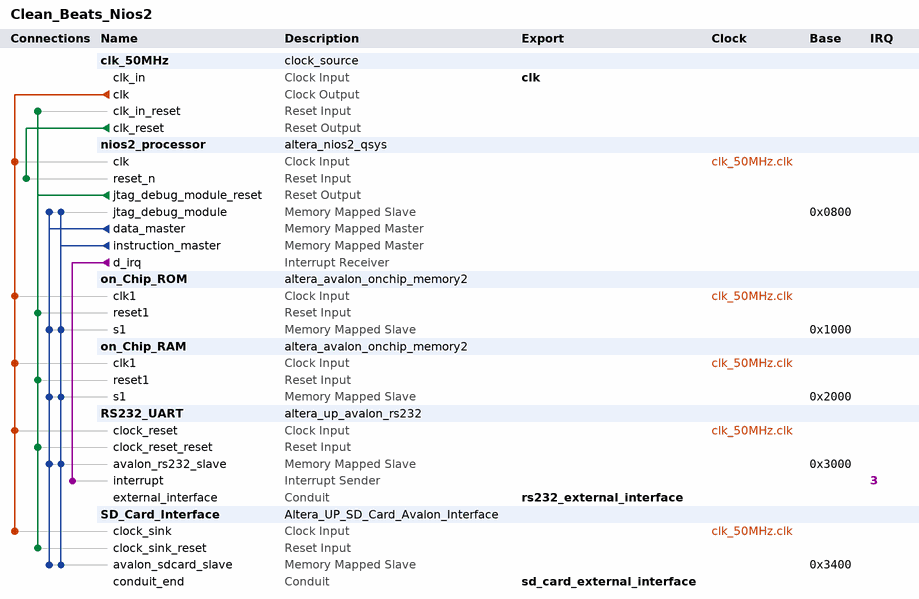
[diagram p0: system contents]
# Platform Designer (Qsys) system Clean_Beats_Nios2, Cyclone III EP3C16F484C6
# Parameters at their usual value, and those the tool derives, are not listed.
package require -exact qsys 12.1
create_system Clean_Beats_Nios2
set_project_property DEVICE_FAMILY {Cyclone III}
set_project_property DEVICE EP3C16F484C6

add_instance clk_50MHz clock_source 12.1
set_instance_parameter_value clk_50MHz clockFrequency 50000000

add_instance nios2_processor altera_nios2_qsys 12.1
set_instance_parameter_value nios2_processor setting_preciseIllegalMemAccessException true
set_instance_parameter_value nios2_processor setting_illegalInstructionsTrap true
set_instance_parameter_value nios2_processor mmu_enabled true
set_instance_parameter_value nios2_processor mmu_TLBMissExcOffset 64
set_instance_parameter_value nios2_processor resetSlave Absolute
set_instance_parameter_value nios2_processor mmu_TLBMissExcSlave Absolute
set_instance_parameter_value nios2_processor exceptionSlave Absolute
set_instance_parameter_value nios2_processor breakSlave nios2_processor.jtag_debug_module
set_instance_parameter_value nios2_processor impl Fast
set_instance_parameter_value nios2_processor icache_size 4096

add_instance on_Chip_ROM altera_avalon_onchip_memory2 12.1
set_instance_parameter_value on_Chip_ROM dataWidth 32
set_instance_parameter_value on_Chip_ROM dualPort false
set_instance_parameter_value on_Chip_ROM initMemContent true
set_instance_parameter_value on_Chip_ROM initializationFileName on_Chip_ROM
set_instance_parameter_value on_Chip_ROM memorySize 4096
set_instance_parameter_value on_Chip_ROM writable false

add_instance on_Chip_RAM altera_avalon_onchip_memory2 12.1
set_instance_parameter_value on_Chip_RAM dataWidth 32
set_instance_parameter_value on_Chip_RAM dualPort false
set_instance_parameter_value on_Chip_RAM initMemContent true
set_instance_parameter_value on_Chip_RAM initializationFileName on_Chip_RAM
set_instance_parameter_value on_Chip_RAM memorySize 4096

add_instance RS232_UART altera_up_avalon_rs232 12.0
set_instance_parameter_value RS232_UART baud 9600
set_instance_parameter_value RS232_UART parity None

add_instance SD_Card_Interface Altera_UP_SD_Card_Avalon_Interface 1.0

# connections
add_connection clk_50MHz.clk nios2_processor.clk clock
add_connection clk_50MHz.clk on_Chip_RAM.clk1 clock
add_connection clk_50MHz.clk on_Chip_ROM.clk1 clock
add_connection clk_50MHz.clk RS232_UART.clock_reset clock
add_connection clk_50MHz.clk SD_Card_Interface.clock_sink clock
add_connection clk_50MHz.clk_reset nios2_processor.reset_n reset
add_connection nios2_processor.jtag_debug_module_reset clk_50MHz.clk_in_reset reset
add_connection nios2_processor.jtag_debug_module_reset on_Chip_RAM.reset1 reset
add_connection nios2_processor.jtag_debug_module_reset on_Chip_ROM.reset1 reset
add_connection nios2_processor.jtag_debug_module_reset RS232_UART.clock_reset_reset reset
add_connection nios2_processor.jtag_debug_module_reset SD_Card_Interface.clock_sink_reset reset
add_connection nios2_processor.data_master nios2_processor.jtag_debug_module avalon
set_connection_parameter_value nios2_processor.data_master/nios2_processor.jtag_debug_module baseAddress 0x0800
add_connection nios2_processor.data_master on_Chip_RAM.s1 avalon
set_connection_parameter_value nios2_processor.data_master/on_Chip_RAM.s1 baseAddress 0x2000
add_connection nios2_processor.data_master on_Chip_ROM.s1 avalon
set_connection_parameter_value nios2_processor.data_master/on_Chip_ROM.s1 baseAddress 0x1000
add_connection nios2_processor.data_master RS232_UART.avalon_rs232_slave avalon
set_connection_parameter_value nios2_processor.data_master/RS232_UART.avalon_rs232_slave baseAddress 0x3000
add_connection nios2_processor.data_master SD_Card_Interface.avalon_sdcard_slave avalon
set_connection_parameter_value nios2_processor.data_master/SD_Card_Interface.avalon_sdcard_slave baseAddress 0x3400
add_connection nios2_processor.instruction_master nios2_processor.jtag_debug_module avalon
set_connection_parameter_value nios2_processor.instruction_master/nios2_processor.jtag_debug_module baseAddress 0x0800
add_connection nios2_processor.instruction_master on_Chip_RAM.s1 avalon
set_connection_parameter_value nios2_processor.instruction_master/on_Chip_RAM.s1 baseAddress 0x2000
add_connection nios2_processor.instruction_master on_Chip_ROM.s1 avalon
set_connection_parameter_value nios2_processor.instruction_master/on_Chip_ROM.s1 baseAddress 0x1000
add_connection nios2_processor.instruction_master RS232_UART.avalon_rs232_slave avalon
set_connection_parameter_value nios2_processor.instruction_master/RS232_UART.avalon_rs232_slave baseAddress 0x3000
add_connection nios2_processor.instruction_master SD_Card_Interface.avalon_sdcard_slave avalon
set_connection_parameter_value nios2_processor.instruction_master/SD_Card_Interface.avalon_sdcard_slave baseAddress 0x3400
add_connection nios2_processor.d_irq RS232_UART.interrupt interrupt
set_connection_parameter_value nios2_processor.d_irq/RS232_UART.interrupt irqNumber 3

# exported interfaces
add_interface clk clock sink
set_interface_property clk EXPORT_OF clk_50MHz.clk_in
add_interface rs232_external_interface conduit end
set_interface_property rs232_external_interface EXPORT_OF RS232_UART.external_interface
add_interface sd_card_external_interface conduit end
set_interface_property sd_card_external_interface EXPORT_OF SD_Card_Interface.conduit_end

save_system Clean_Beats_Nios2.qsys
